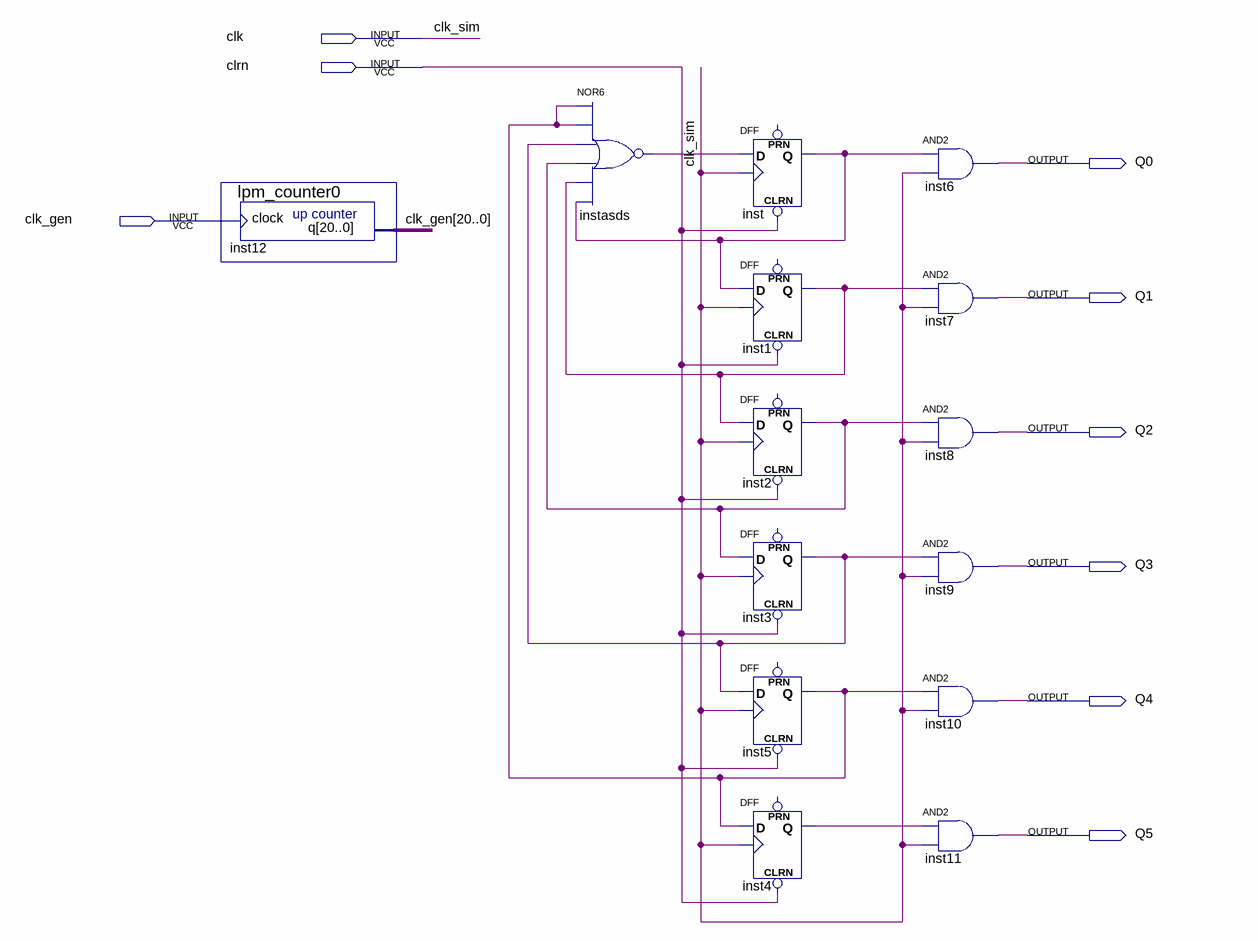
[diagram p0: schematic sheet]
// Quartus schematic lab6part1.bdf as structural Verilog: 14 symbols, 9 pins
module lab6part1 (
  input  clk,
  input  clrn,
  input  clk_gen,
  output Q0,
  output Q1,
  output Q2,
  output Q3,
  output Q4,
  output Q5
);

  wire inst1_q, inst2_q, inst3_q, inst4_q, inst5_q, inst_q, instasds_out;
  wire [20:0] clk_gen_bus;

  lpm_counter0 inst12 (.clock(clk_gen), .q(clk_gen_bus));
  nor instasds (instasds_out, inst5_q, inst5_q, inst3_q, inst2_q, inst1_q, inst_q);
  DFF inst (.CLRN(clrn), .CLK(clk), .D(instasds_out), .Q(inst_q));  // open: PRN
  DFF inst1 (.CLRN(clrn), .CLK(clk), .D(inst_q), .Q(inst1_q));  // open: PRN
  DFF inst2 (.CLRN(clrn), .CLK(clk), .D(inst1_q), .Q(inst2_q));  // open: PRN
  DFF inst3 (.CLRN(clrn), .CLK(clk), .D(inst2_q), .Q(inst3_q));  // open: PRN
  DFF inst5 (.CLRN(clrn), .CLK(clk), .D(inst3_q), .Q(inst5_q));  // open: PRN
  DFF inst4 (.CLRN(clrn), .CLK(clk), .D(inst5_q), .Q(inst4_q));  // open: PRN
  and inst6 (Q0, inst_q, clk);
  and inst7 (Q1, inst1_q, clk);
  and inst8 (Q2, inst2_q, clk);
  and inst9 (Q3, inst3_q, clk);
  and inst10 (Q4, inst5_q, clk);
  and inst11 (Q5, inst4_q, clk);

  // Other names for the same wires on the sheet: clk_sim = clk
endmodule
